# Altium schematic sheet Processor_2.SchDoc
size 420 x 297 mm; CmpIndex: 87; SymIndex: 30
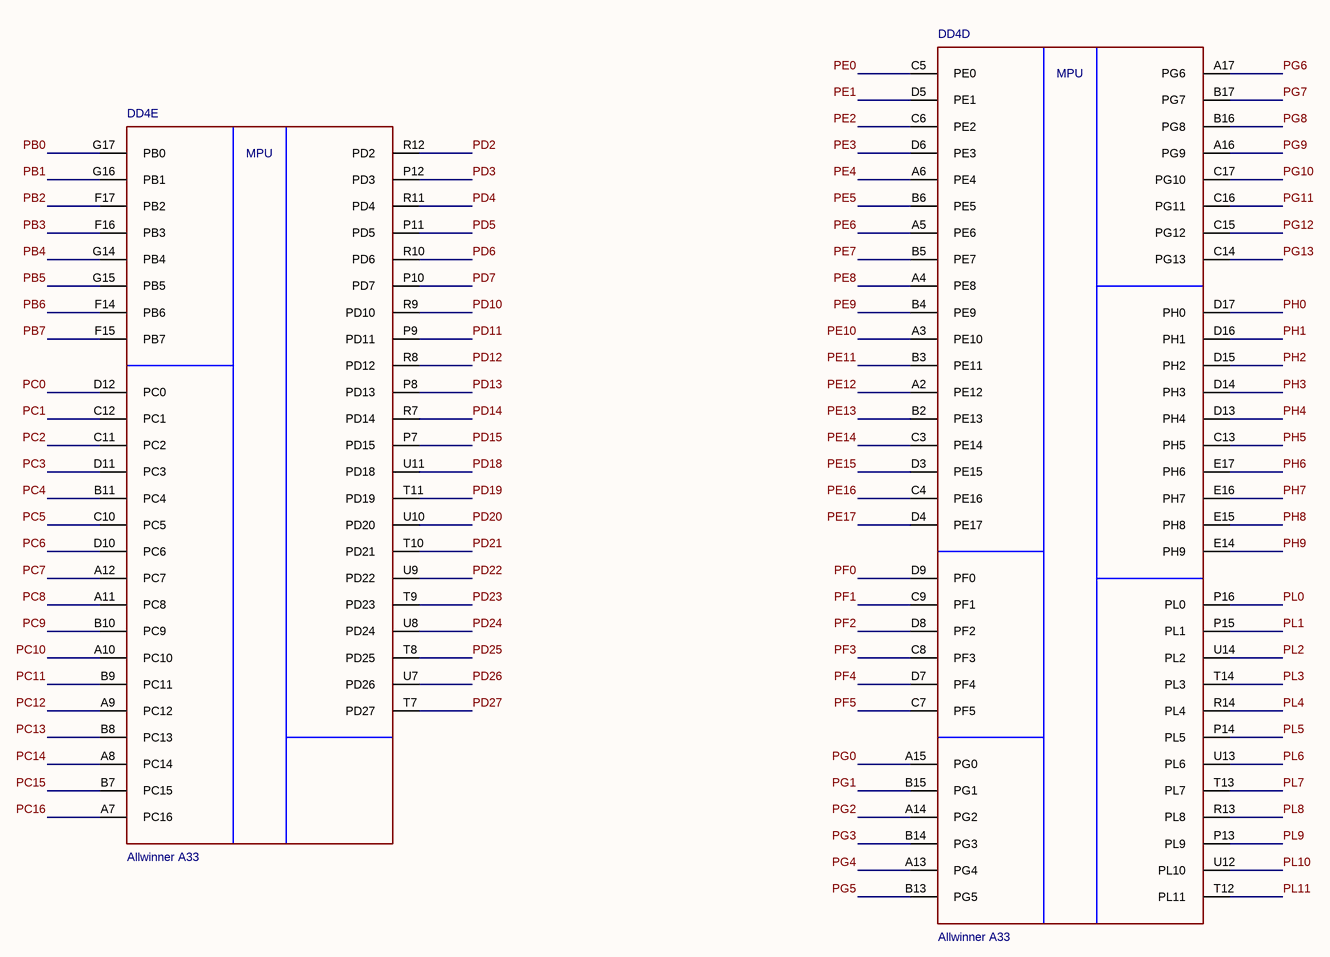
[diagram p0: Processor_2.SchDoc]

## Parts
DD4  Allwinner A33  (parts D,E of 7)

## Nets
PB0: DD4.G17(PB0)
PB1: DD4.G16(PB1)
PB2: DD4.F17(PB2)
PB3: DD4.F16(PB3)
PB4: DD4.G14(PB4)
PB5: DD4.G15(PB5)
PB6: DD4.F14(PB6)
PB7: DD4.F15(PB7)
PC0: DD4.D12(PC0)
PC1: DD4.C12(PC1)
PC2: DD4.C11(PC2)
PC3: DD4.D11(PC3)
PC4: DD4.B11(PC4)
PC5: DD4.C10(PC5)
PC6: DD4.D10(PC6)
PC7: DD4.A12(PC7)
PC8: DD4.A11(PC8)
PC9: DD4.B10(PC9)
PC10: DD4.A10(PC10)
PC11: DD4.B9(PC11)
PC12: DD4.A9(PC12)
PC13: DD4.B8(PC13)
PC14: DD4.A8(PC14)
PC15: DD4.B7(PC15)
PC16: DD4.A7(PC16)
PD2: DD4.R12(PD2)
PD3: DD4.P12(PD3)
PD4: DD4.R11(PD4)
PD5: DD4.P11(PD5)
PD6: DD4.R10(PD6)
PD7: DD4.P10(PD7)
PD10: DD4.R9(PD10)
PD11: DD4.P9(PD11)
PD12: DD4.R8(PD12)
PD13: DD4.P8(PD13)
PD14: DD4.R7(PD14)
PD15: DD4.P7(PD15)
PD18: DD4.U11(PD18)
PD19: DD4.T11(PD19)
PD20: DD4.U10(PD20)
PD21: DD4.T10(PD21)
PD22: DD4.U9(PD22)
PD23: DD4.T9(PD23)
PD24: DD4.U8(PD24)
PD25: DD4.T8(PD25)
PD26: DD4.U7(PD26)
PD27: DD4.T7(PD27)
PE0: DD4.C5(PE0)
PE1: DD4.D5(PE1)
PE2: DD4.C6(PE2)
PE3: DD4.D6(PE3)
PE4: DD4.A6(PE4)
PE5: DD4.B6(PE5)
PE6: DD4.A5(PE6)
PE7: DD4.B5(PE7)
PE8: DD4.A4(PE8)
PE9: DD4.B4(PE9)
PE10: DD4.A3(PE10)
PE11: DD4.B3(PE11)
PE12: DD4.A2(PE12)
PE13: DD4.B2(PE13)
PE14: DD4.C3(PE14)
PE15: DD4.D3(PE15)
PE16: DD4.C4(PE16)
PE17: DD4.D4(PE17)
PF0: DD4.D9(PF0)
PF1: DD4.C9(PF1)
PF2: DD4.D8(PF2)
PF3: DD4.C8(PF3)
PF4: DD4.D7(PF4)
PF5: DD4.C7(PF5)
PG0: DD4.A15(PG0)
PG1: DD4.B15(PG1)
PG2: DD4.A14(PG2)
PG3: DD4.B14(PG3)
PG4: DD4.A13(PG4)
PG5: DD4.B13(PG5)
PG6: DD4.A17(PG6)
PG7: DD4.B17(PG7)
PG8: DD4.B16(PG8)
PG9: DD4.A16(PG9)
PG10: DD4.C17(PG10)
PG11: DD4.C16(PG11)
PG12: DD4.C15(PG12)
PG13: DD4.C14(PG13)
PH0: DD4.D17(PH0)
PH1: DD4.D16(PH1)
PH2: DD4.D15(PH2)
PH3: DD4.D14(PH3)
PH4: DD4.D13(PH4)
PH5: DD4.C13(PH5)
PH6: DD4.E17(PH6)
PH7: DD4.E16(PH7)
PH8: DD4.E15(PH8)
PH9: DD4.E14(PH9)
PL0: DD4.P16(PL0)
PL1: DD4.P15(PL1)
PL2: DD4.U14(PL2)
PL3: DD4.T14(PL3)
PL4: DD4.R14(PL4)
PL5: DD4.P14(PL5)
PL6: DD4.U13(PL6)
PL7: DD4.T13(PL7)
PL8: DD4.R13(PL8)
PL9: DD4.P13(PL9)
PL10: DD4.U12(PL10)
PL11: DD4.T12(PL11)

## Notes on the sheet
- Лист
- Изм.
- № Докум.
- Подп.
- Дата
- (in symbol Allwinner A33, part D) MPU
- (in symbol Allwinner A33, part E) MPU

## Library data of the parts
DD4 = Allwinner A33: CmpIndex: 83; DXDB_LIBNAME: Embedded Microprocessors; Ref Designator: DD4; SymIndex: 35; Orientation: 0 = 0; Part Label: Allwinner A33; Part Name: Allwinner A33; Part Number NP: Allwinner A33; Part Number: Allwinner A33